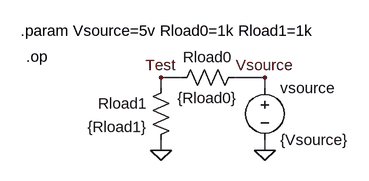
[diagram p0: schematic simple_resistance_circuit.asc]
simple_resistance_circuit.asc, the LTspice schematic file:
Version 4
SHEET 1 880 680
WIRE 144 96 112 96
WIRE 272 96 224 96
WIRE 112 112 112 96
WIRE 272 112 272 96
WIRE 112 208 112 192
WIRE 272 208 272 192
FLAG 272 208 0
FLAG 112 208 0
FLAG 272 96 Vsource
FLAG 112 96 Test
SYMBOL voltage 272 96 R0
WINDOW 123 0 0 Left 2
WINDOW 39 0 0 Left 2
SYMATTR InstName vsource
SYMATTR Value {Vsource}
SYMBOL res 240 80 R90
WINDOW 0 0 56 VBottom 2
WINDOW 3 32 56 VTop 2
SYMATTR InstName Rload0
SYMATTR Value {Rload0}
SYMBOL res 128 96 M0
SYMATTR InstName Rload1
SYMATTR Value {Rload1}
TEXT -104 24 Left 2 !.param Vsource=5v Rload0=1k Rload1=1k
TEXT -96 64 Left 2 !.op

The netlist it stands for:
* simple_resistance_circuit.asc
vsource Vsource 0 {Vsource}
Rload0 Vsource Test {Rload0}
Rload1 Test 0 {Rload1}
.param Vsource=5v Rload0=1k Rload1=1k
.op
.backanno
.end